# EAGLE design rev16 (EAGLE 7.5.0)
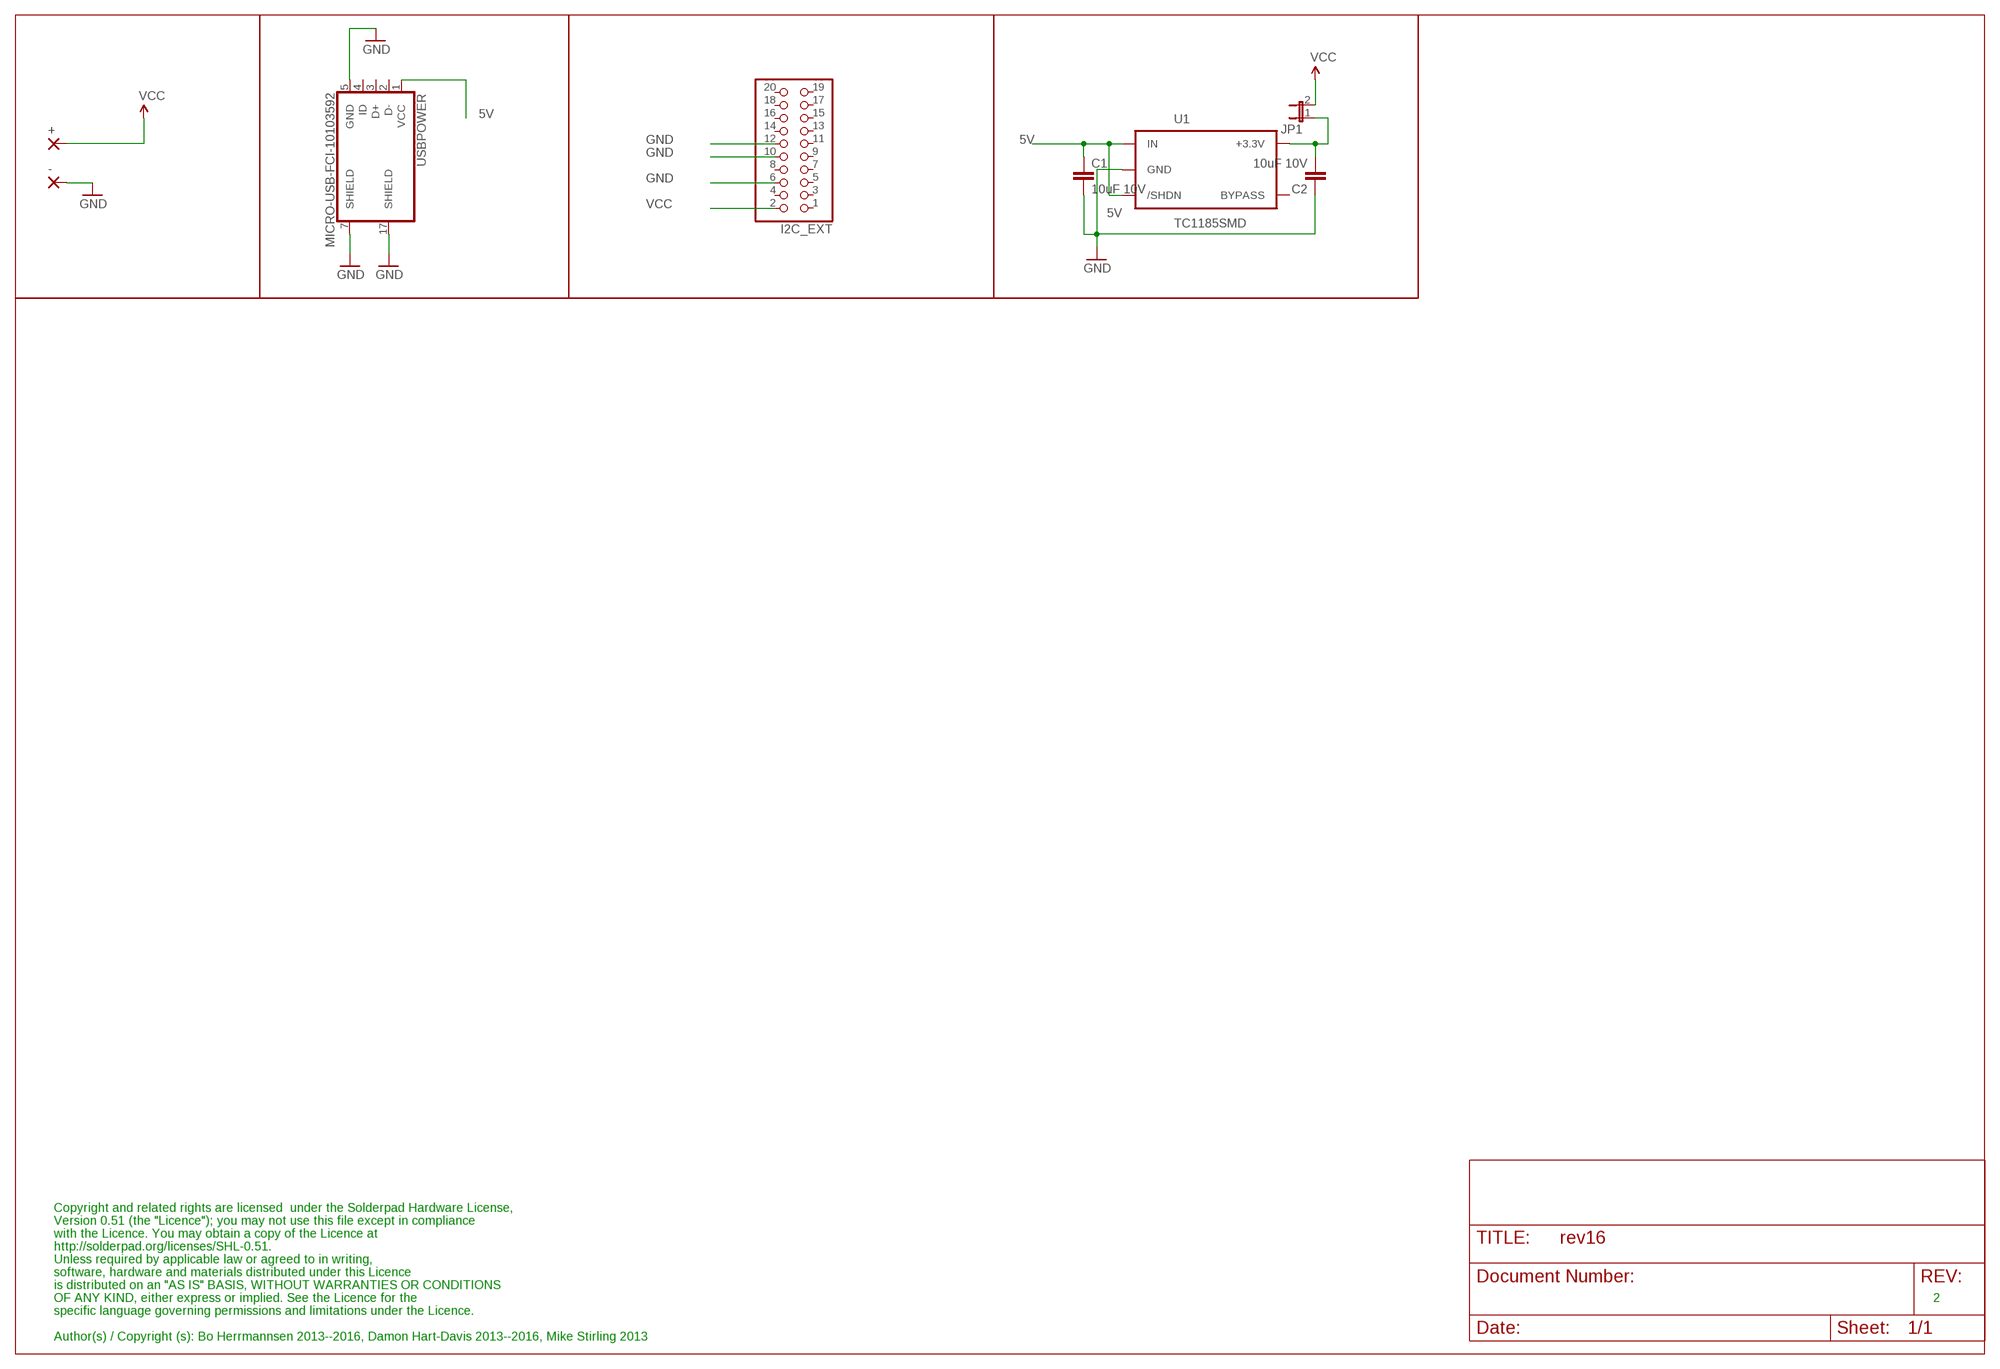
[diagram p0: schematic, sheet 1]

## Parts
+  2,15/1,0  [2,15/1,0]
-  2,15/1,0  [2,15/1,0]
C1  10uF 10V  CAP0603-CAP  [0603-CAP]
C2  10uF 10V  CAP0603-CAP  [0603-CAP]
I2C_EXT  PINHD-2X10  [2X10]
JP1  JP1E  [JP1]
U1  TC1185SMD  [TC1185]
USBPOWER  MICRO-USB-FCI-10103592  [MICRO-USB-FCI-10103592]

## Nets
5V [supply]: C1.1 U1.1(IN) U1.3(/SHDN) USBPOWER.1(VCC)
GND [supply]: -.1(P) C1.2 C2.1 I2C_EXT.6 I2C_EXT.10 I2C_EXT.12 U1.2(GND) USBPOWER.5(GND) USBPOWER.7(SHIELD) USBPOWER.17(SHIELD)
N$8 [supply]: C2.2 JP1.1 U1.5(+3.3V)
VCC [supply]: +.1(P) I2C_EXT.2 JP1.2
Unconnected: I2C_EXT.1 I2C_EXT.3 I2C_EXT.4 I2C_EXT.5 I2C_EXT.7 I2C_EXT.8 I2C_EXT.9 I2C_EXT.11 I2C_EXT.13 I2C_EXT.14 I2C_EXT.15 I2C_EXT.16 I2C_EXT.17 I2C_EXT.18 I2C_EXT.19 I2C_EXT.20 U1.4(BYPASS) USBPOWER.2(D-) USBPOWER.3(D+) USBPOWER.4(ID)

## Notes on the sheet
- Copyright and related rights are licensed  under the Solderpad Hardware License,
- Version 0.51 (the "Licence"); you may not use this file except in compliance
- with the Licence. You may obtain a copy of the Licence at
- http://solderpad.org/licenses/SHL-0.51.
- Unless required by applicable law or agreed to in writing,
- software, hardware and materials distributed under this Licence
- is distributed on an "AS IS" BASIS, WITHOUT WARRANTIES OR CONDITIONS
- OF ANY KIND, either express or implied. See the Licence for the | 2
- specific language governing permissions and limitations under the Licence.
- Author(s) / Copyright (s): Bo Herrmannsen 2013--2016, Damon Hart-Davis 2013--2016, Mike Stirling 2013

## Library data of the parts
+ - = wirepad:2,15/1,0: THROUGH-HOLE PAD
C1 C2 = SparkFun-Passives:CAP: Capacitor Standard 0603 ceramic capacitor, and 0.1" leaded capacitor.
I2C_EXT = pinhead:PINHD-2X10: PIN HEADER
JP1 = jumper:JP1E: JUMPER
U1 = 3.3VREG:TC1185
USBPOWER = micro-usb-fci-10103592:MICRO-USB-FCI-10103592: Micro USB B Connector RS No: 714-2334 MRF No: 10103592-0001LF

## Net classes
0 default: width 0.203 mm
1 supply: width 0.406 mm, clearance 0.203 mm
2 ant: width 2.184 mm

## Board
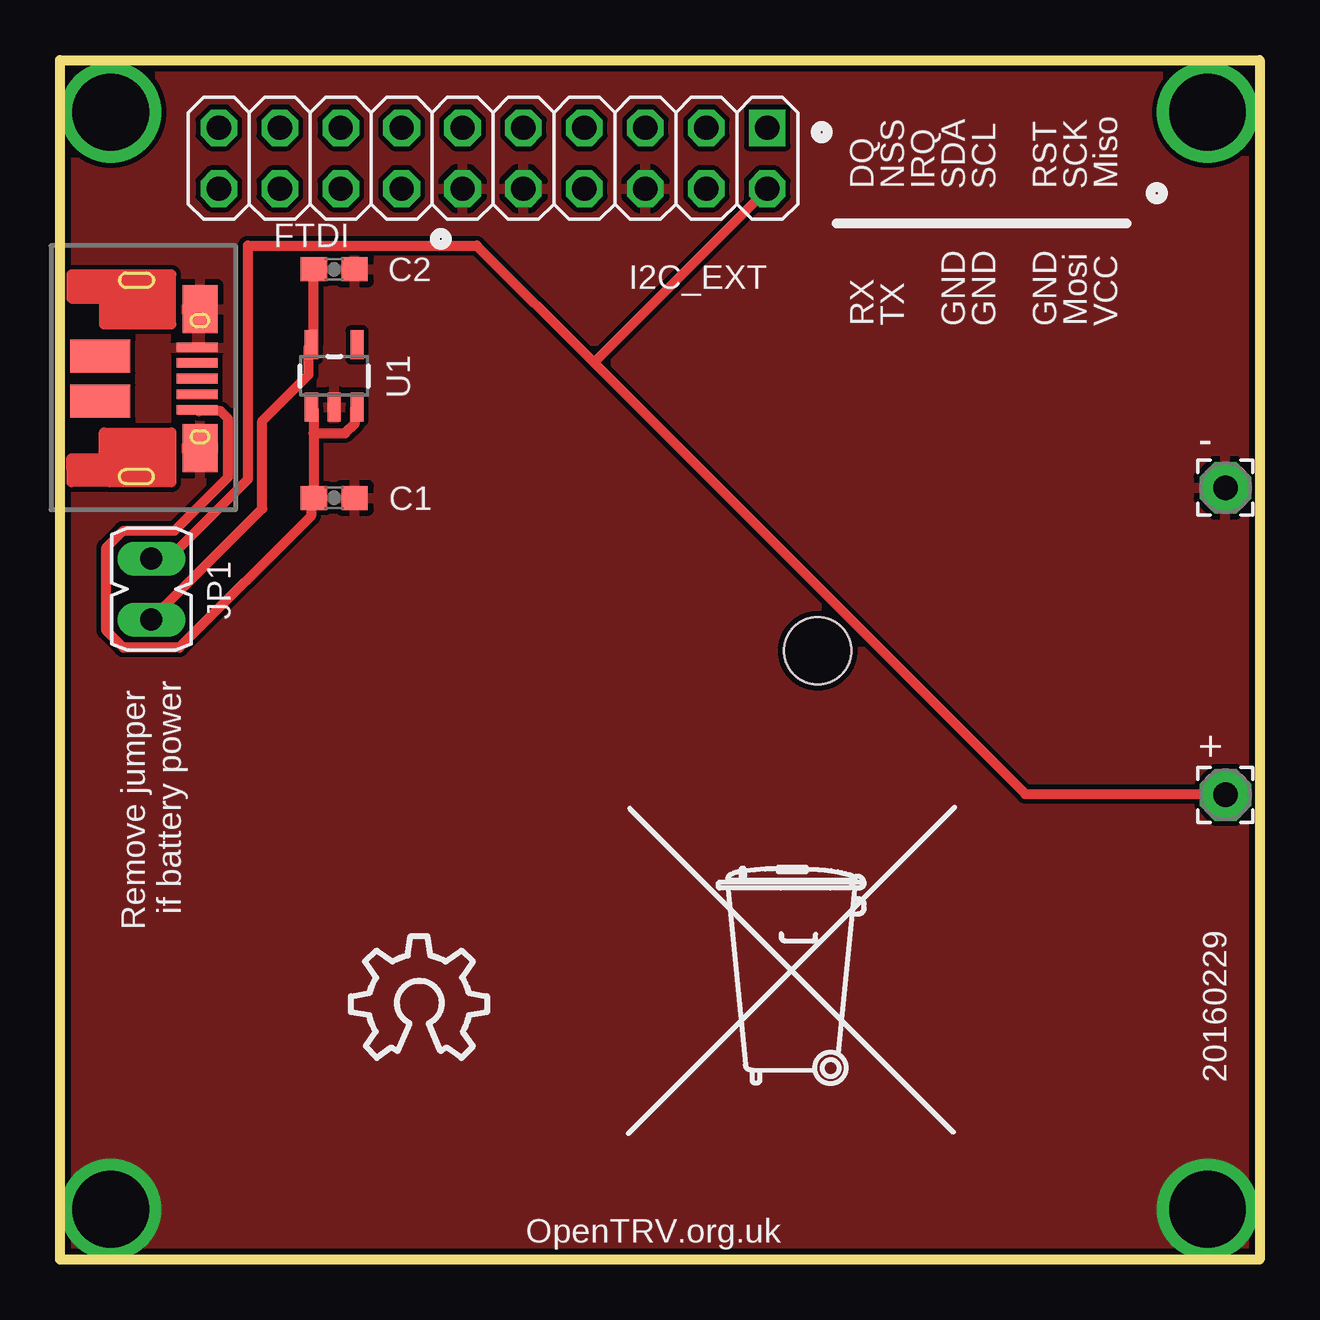
[diagram p1: board, top side]
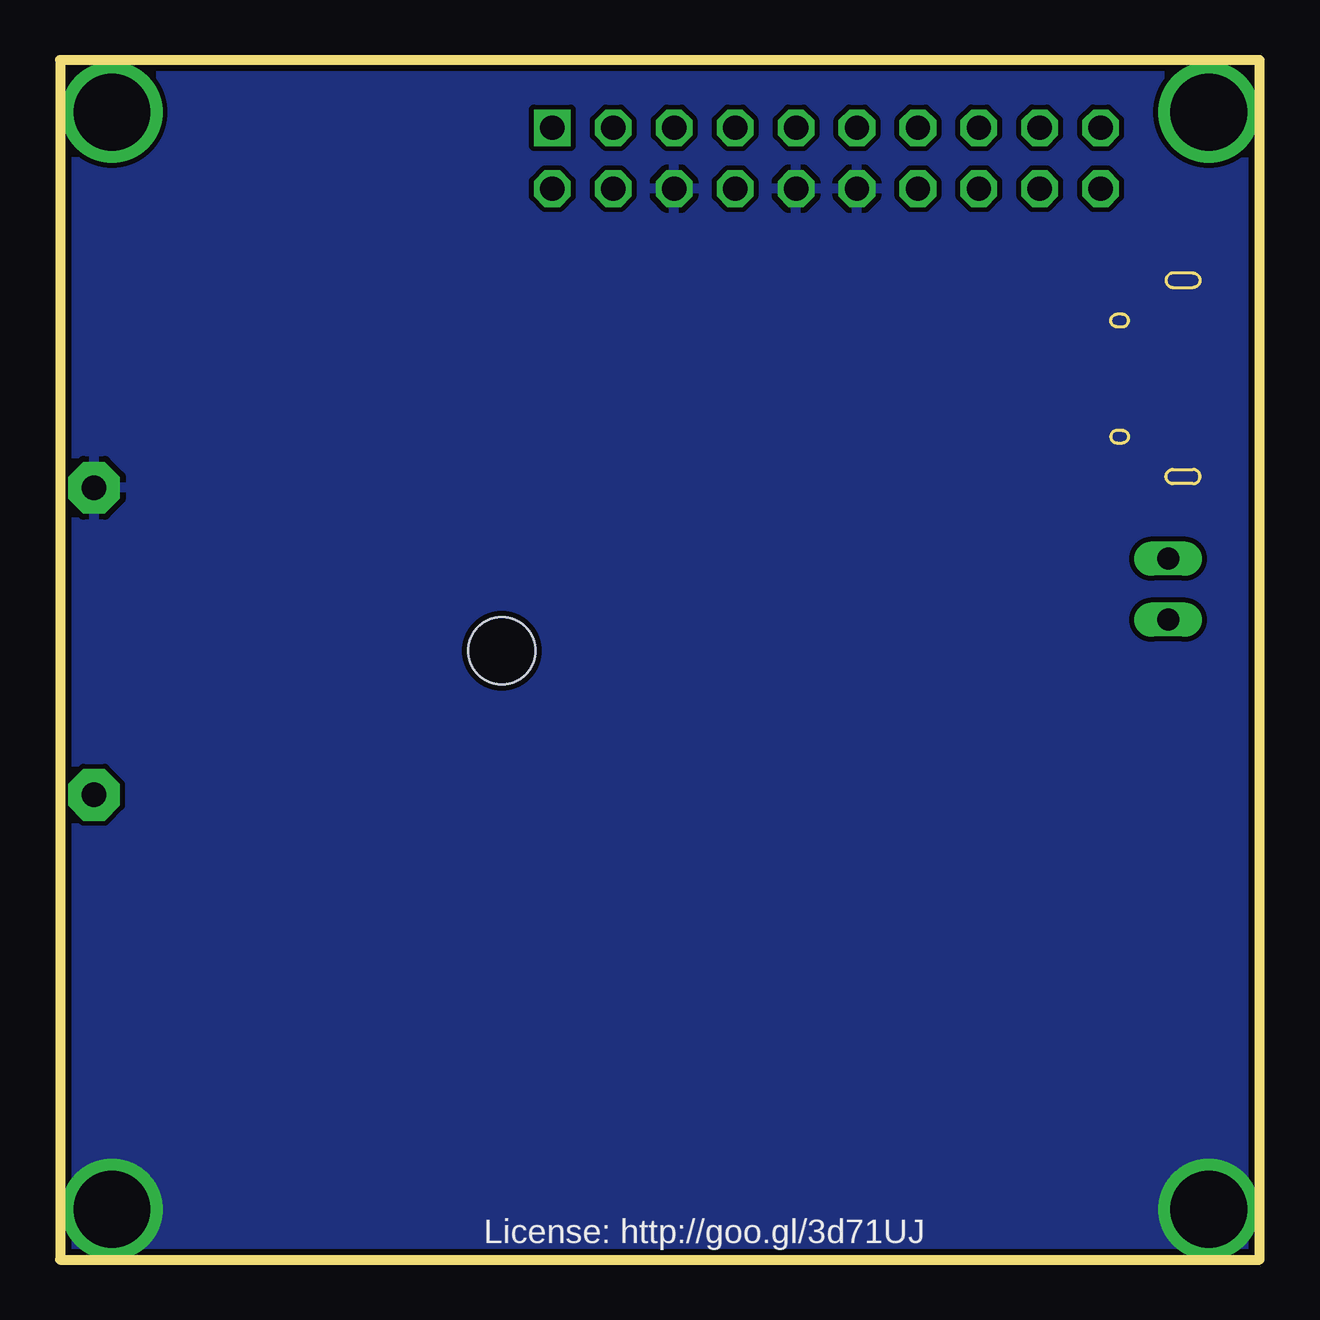
[diagram p2: board, bottom side, seen from below]

Size 50 x 50 mm. Coordinates in mm from the lower left corner, seen from the top.
Outline: 0,0 0,50 50,50 50,0 0,0
Copper layers (1*16): Top 0.035mm / dielectric 1.5mm / Bottom 0.035mm
Design rules "PMServicesStd *": minimum track width 8mil, minimum drill 0.5mm, track to track 8mil, track to pad 8mil, pad to pad 8mil, via to via 8mil, smd to smd 0mil, copper to edge 10mil, drill to drill 10mil, minimum pad ring 10mil, minimum via ring 6mil, stop-mask expansion 2mil, vias tented up to drill 100mil, thermal gap 10mil
Holes 2.8 mm at 31.58,25.37

### Footprints (pad centres in the part's own frame; a part is rotated, then mirrored left to right if it is on the bottom)
2,15/1,0 = drill 1.016 pad 2.159 octagon: 1 0,0
0603-CAP = smd 1.1 x 1: 1 -0.85,0; 2 0.85,0
2X10 = drill 1.016 square: 1 -11.43,-1.27 | drill 1.016 octagon: 2 -11.43,1.27; 3 -8.89,-1.27; 4 -8.89,1.27; 5 -6.35,-1.27; 6 -6.35,1.27; 7 -3.81,-1.27; 8 -3.81,1.27; 9 -1.27,-1.27; 10 -1.27,1.27; 11 1.27,-1.27; 12 1.27,1.27; 13 3.81,-1.27; 14 3.81,1.27; 15 6.35,-1.27; 16 6.35,1.27; 17 8.89,-1.27; 18 8.89,1.27; 19 11.43,-1.27; 20 11.43,1.27
JP1 = drill 0.914 long: 1 0,-1.27; 2 0,1.27
TC1185 = smd 0.55 x 1.2: 1 -0.95,-1.3; 2 0,-1.3; 3 0.95,-1.3; 4 0.95,1.3; 5 -0.95,1.3
MICRO-USB-FCI-10103592 = smd 0.4 x 1.71: 1 3.84,2.51; 2 3.19,2.51; 3 2.54,2.51; 4 1.89,2.51; 5 1.24,2.51 | smd 2 x 1.46: 7 -0.36,2.64; 17 5.44,2.64 | smd 1.375 x 2.5: 11 1.603,-1.52; 12 3.478,-1.52

### Placement (x,y rotation side)
+  48.58,19.37 0 top
-  48.58,32.17 0 top
C1  11.43,31.75 0 top
C2  11.43,41.27 180 top
I2C_EXT  18.05,45.91 180 top
JP1  3.81,27.94 0 top
U1  11.43,36.83 0 top
U$1  [OSHW_10X200_NOTEXT]  12.13,8.41 0 top
U$2  [TONNE]  30.34,9.31 0 top
USBPOWER  3.2,39.26 270 top

### Tracks (layer width: path | path; a pad name or v marks a point on that pad's centre or on a via)
5V
  Top 0.406: 10.57,34.44 10.57,35.46 U1.1 | 10.57,34.44 10.57,31.8 C1.1 10.46,31.6 10.46,30.99 4.98,25.5 2.64,25.5 1.93,26.21 1.93,29.67 2.64,30.38 4.78,30.38 7.01,32.61 7.01,35.05 6.71,35.36 5.79,35.36 USBPOWER.1 | 10.57,34.44 11.89,34.44 12.29,34.85 12.29,35.46 U1.3
GND  (via drill 3.2)
  other vias: 47.83,2.1 2.11,2.1
  pour Bottom: 0,50 0,0 50,0 50,50
  pour Top: 0,50 0,0 50,0 50,50
GND1  (via drill 3.2)
  other vias: 47.83,47.82 2.11,47.82
N$8
  Top 0.406: C2.2 10.57,41.25 10.57,38.2 U1.5 10.36,38 10.36,36.88 8.43,34.95 8.43,31.29 JP1.1
VCC
  Top 0.406: JP1.2 3.86,29.26 4.57,29.26 7.82,32.51 7.82,42.27 17.37,42.27 22.25,37.39 | 22.25,37.39 40.23,19.41 48.56,19.41 +.1 | 22.25,37.39 29.46,44.6 I2C_EXT.2

### Text on the board
bPlace: License: http://goo.gl/3d71UJ
tNames: DQ | NSS | IRQ | SDA | SCL | RST | SCK | Miso | FTDI | RX | TX | GND | GND | GND | Mosi | VCC | Remove jumper / if battery power | 20160229 | OpenTRV.org.uk